# Altium project Senior Design.PrjPcb (part 1 of 2)
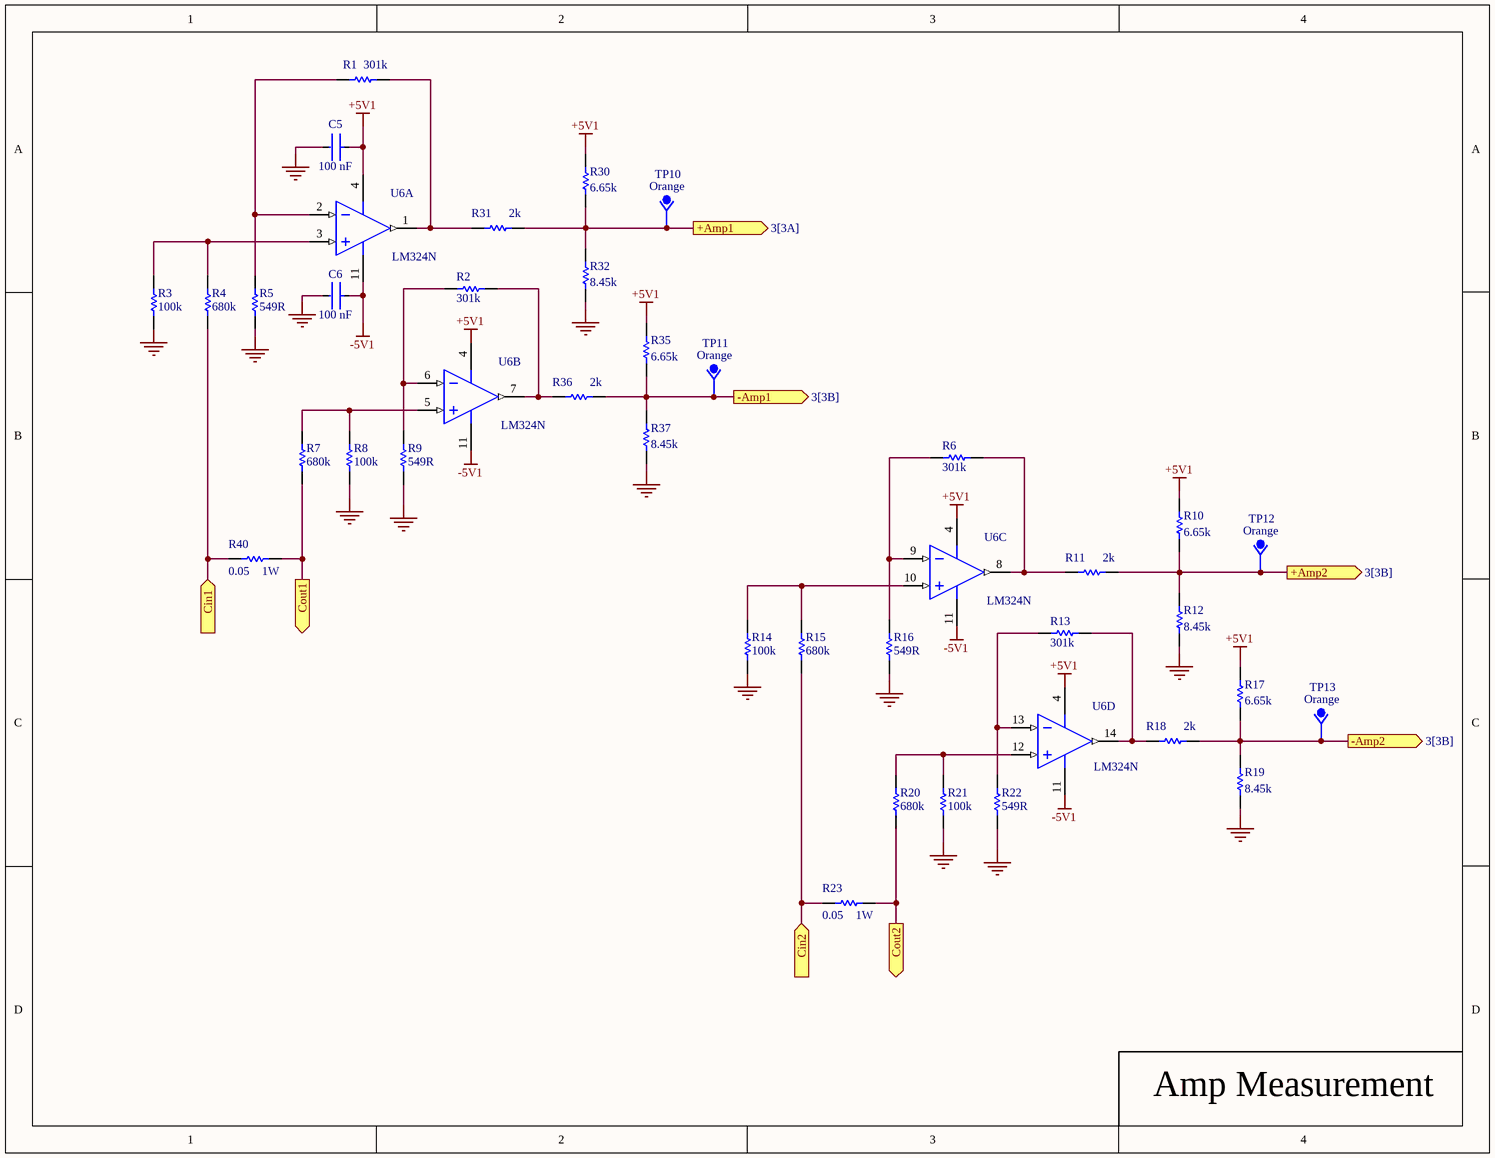
[diagram p0: Amp_Measurement.SchDoc]
3 sheets, 127 parts. Net scope: flat (ports and power ports of the same name join across sheets).
Board file: PCB.PcbDoc
Sheets:
  Amp_Measurement.SchDoc
  Volt_Measurement.SchDoc
  Data-Power.SchDoc

## Sheet Amp_Measurement.SchDoc
size Letter; SheetNumber: 1; SheetTotal: 3; SPICEModelCacheDOOVHHKG: <root> / <DocumentId>DOOVHHKG</DocumentId> / </root>; SheetName: Amp Measurement

### Parts
C5  value 100 nF  [FP-CC0805-0_85-MFG]  (hidden comment: 100nF)
C6  value 100 nF  [FP-CC0805-0_85-MFG]  (hidden comment: 100nF)
R1  value 301k  [0805 Res]  (hidden comment: 301k Ohm)
R2  value 301k  [0805 Res]  (hidden comment: 301k Ohm)
R3  value 100k  [0805 Res]  (hidden comment: 100k Ohm)
R4  value 680k  [0805 Res]  (hidden comment: 680k Ohm)
R5  value 549R  [0805 Res]  (hidden comment: 549 Ohm)
R6  value 301k  [0805 Res]  (hidden comment: 301k Ohm)
R7  value 680k  [0805 Res]  (hidden comment: 680k Ohm)
R8  value 100k  [0805 Res]  (hidden comment: 100k Ohm)
R9  value 549R  [0805 Res]  (hidden comment: 549 Ohm)
R10  value 6.65k  [0805 Res]  (hidden comment: 6.65k Ohm)
R11  value 2k  [0805 Res]  (hidden comment: 2k Ohm)
R12  value 8.45k  [0805 Res]  (hidden comment: 8.45k Ohm)
R13  value 301k  [0805 Res]  (hidden comment: 301k Ohm)
R14  value 100k  [0805 Res]  (hidden comment: 100k Ohm)
R15  value 680k  [0805 Res]  (hidden comment: 680k Ohm)
R16  value 549R  [0805 Res]  (hidden comment: 549 Ohm)
R17  value 6.65k  [0805 Res]  (hidden comment: 6.65k Ohm)
R18  value 2k  [0805 Res]  (hidden comment: 2k Ohm)
R19  value 8.45k  [0805 Res]  (hidden comment: 8.45k Ohm)
R20  value 680k  [0805 Res]  (hidden comment: 680k Ohm)
R21  value 100k  [0805 Res]  (hidden comment: 100k Ohm)
R22  value 549R  [0805 Res]  (hidden comment: 549 Ohm)
R23  value 0.05  Power: 1W  [1206 Res]  (hidden comment: 0.05 Ohm, 1W)
R30  value 6.65k  [0805 Res]  (hidden comment: 6.65k Ohm)
R31  value 2k  [0805 Res]  (hidden comment: 2k Ohm)
R32  value 8.45k  [0805 Res]  (hidden comment: 8.45k Ohm)
R35  value 6.65k  [0805 Res]  (hidden comment: 6.65k Ohm)
R36  value 2k  [0805 Res]  (hidden comment: 2k Ohm)
R37  value 8.45k  [0805 Res]  (hidden comment: 8.45k Ohm)
R40  value 0.05  Power: 1W  [1206 Res]  (hidden comment: 0.05 Ohm, 1W)
TP10  Color: Orange  [ORANGETP]  (hidden comment: TP (Orange))
TP11  Color: Orange  [ORANGETP]  (hidden comment: TP (Orange))
TP12  Color: Orange  [ORANGETP]  (hidden comment: TP (Orange))
TP13  Color: Orange  [ORANGETP]  (hidden comment: TP (Orange))
U6  Manufacturer Part Number: LM324N  [N0014A]  (hidden comment: 4CH Op-Amp)  (parts A,B,C,D of 4)

### Ports
+Amp1 (out, see 3[3A]), +Amp2 (out, see 3[3B]), -Amp1 (out, see 3[3B]), -Amp2 (out, see 3[3B]), Cin1 (in), Cin2 (in), Cout1 (out), Cout2 (out)

### Nets
+5V1: C5.1 R10.2 R17.2 R30.2 R35.2 U6.4(V+)
-5V1: C6.1 U6.11(GND)
GND: C5.2 C6.2 R3.2 R5.1 R8.2 R9.1 R12.1 R14.2 R16.1 R19.1 R21.2 R22.1 R32.1 R37.1
NetR1_1: R1.1 R31.2 U6.1(OUT1)
NetR1_2: R1.2 R5.2 U6.2(IN1-)
NetR2_1: R2.1 R36.2 U6.7(OUT2)
NetR2_2: R2.2 R9.2 U6.6(IN2-)
NetR3_1: R3.1 R4.2 U6.3(IN1+)
NetR4_1: R4.1 R40.1 ; port Cin1
NetR6_1: R6.1 R11.2 U6.8(OUT3)
NetR6_2: R6.2 R16.2 U6.9(IN3-)
NetR7_1: R7.1 R40.2 ; port Cout1
NetR7_2: R7.2 R8.1 U6.5(IN2+)
NetR10_1: R10.1 R11.1 R12.2 TP12.1(TP) ; port +Amp2
NetR13_1: R13.1 R18.2 U6.14(OUT4)
NetR13_2: R13.2 R22.2 U6.13(IN4-)
NetR14_1: R14.1 R15.2 U6.10(IN3+)
NetR15_1: R15.1 R23.1 ; port Cin2
NetR17_1: R17.1 R18.1 R19.2 TP13.1(TP) ; port -Amp2
NetR20_1: R20.1 R23.2 ; port Cout2
NetR20_2: R20.2 R21.1 U6.12(IN4+)
NetR30_1: R30.1 R31.1 R32.2 TP10.1(TP) ; port +Amp1
NetR35_1: R35.1 R36.1 R37.2 TP11.1(TP) ; port -Amp1

### Library data of the parts
C5 C6 = CMP-1036-04402-6: CAP CER 0.1UF 16V X7R 0805; Manufacturer Part Number: CC0805KRX7R7BB104; Manufacturer: Yageo; Material: Ceramic; Tolerance: 0.1; Temperature: -30°C to +85°C; Lead Free: Yes; Footprint Url: http://www.yageo.com/exep/pages/download/literatures/UPY-C_GEN_24.pdf; Voltage Rating: 16 V; Package: CC0805-0.85; RoHS: TRUE; Digikey Description: CAP CER 0.1UF 16V X7R 0805; Category: Cap; Octopart: https://octopart.com/cc0805krx7r7bb104-yageo-39467769; Capacitance: 100 nF; Device Class L3: Ceramic Capacitors; ComponentLink2URL: http://www.yageo.com/documents/recent/UPY-GPHC_Y5V_6.3V-to-50V_8.pdf; Temperature Range Low: -30°C; Mouser Description: Multilayer Ceramic Capacitors MLCC - SMD/SMT 100nF 16V X7R 10%; Automotive: No; Device Class L2: Capacitors; Height: 0.95mm; ComponentLink2Description: Datasheet; Temperature Characteristic: X7R; Ipc Land Pattern Name: CAPC200125X85; Device Class L1: Passive Components; Temperature Range High: +85°C
R1 R2 R6 R13 = Res1: Fixed Resistor, Metal Glaze/thick Film, 0.125W, 301000ohm, 150V, 1% +/-Tol, 100ppm/Cel, Surface Mount, 0805; Manufacturer: Stackpole Electronics; Manufacturer Part Number: RMCF0805JT100K; Tolerance: 5%; Power: 125mW; Rated Temperature: 70°C; Temperature Coefficient (ppm/Cel): 200; Package Height: 0.5mm; Package Length: 2mm; Package Width: 1.25mm; Reference Standard: AEC-Q200; Published: 8-Jun-2000; LatestRevisionDate: 17-Jul-2002; LatestRevisionNote: Re-released for DXP Platform.; PackageReference: AXIAL-0.3; Publisher: Altium Limited; PackageDescription: Axial Device, Thru-Hole; 2 Leads; 0.3 in Pin Spacing; Supplier 1: Avnet; Supplier Part Number 1: RMCF0805JT100K; RoHS: Yes; Category: Chip SMD Resistors; Stock 1: 1265000; Pricing 1: 5000=0.00196, 10000=0.00193, 20000=0.0019, 30000=0.00188, 40000=0.00185 (USD); Mounting Technology: Surface Mount; Pins: 2; Package Shape: Rectangular; Case/Package: 0805; Terminal Finish: Nickel; Min Operating Temperature: -55°C; Max Operating Temperature: 155°C; JESD-609 Code: e3; Resistor Type: FIXED RESISTOR; Construction: Rectangular; Packaging: Tape and Reel; Technology: METAL GLAZE/THICK FILM; Termination: Wraparound; Working Voltage: 150V; Reach SVHC Compliant: Yes; RoHS Compliant: Yes; ComponentLink1URL: https://datasheet.ciiva.com:443/pdfs/VipMasterIC/IC/SEIE/SEIE-S-A0009541969/SEIE-S-A0009541969-1.pdf?src-supplier=IHS+Markit; ComponentLink1Description: https://datasheet.ciiva.com:443/pdfs/VipMasterIC/IC/SEIE/SEIE-S-A0009541969/SEIE-S-A0009541969-1.pdf?src-supplier=IHS+Markit; ComponentLink2URL: http://components.arrow.com/part/dataview/50503311S7171745N1174?src-supplier=Arrow+Electronics; ComponentLink2Description: http://components.arrow.com/part/dataview/50503311S7171745N1174?src-supplier=Arrow+Electronics; ComponentLink3URL: https://www.seielect.com/catalog/SEI-Packaging.pdf?src-supplier=Digikey; ComponentLink3Description: https://www.seielect.com/catalog/SEI-Packaging.pdf?src-supplier=Digikey; ComponentLink4URL: https://www.verical.com/server-webapp/html/getDatasheet?partID=366462&src-supplier=Verical; ComponentLink4Description: https://www.verical.com/server-webapp/html/getDatasheet?partID=366462&src-supplier=Verical; ComponentLink5URL: https://www.seielect.com/catalog/SEI-RMCF_RMCP.pdf?src-supplier=Avnet; ComponentLink5Description: https://www.seielect.com/catalog/SEI-RMCF_RMCP.pdf?src-supplier=Avnet; ComponentLink6URL: https://datasheet.octopart.com/RMCF0805JT100K-Stackpole-Electronics-datasheet-11547379.pdf?src-supplier=Future+Electronics; ComponentLink6Description: https://datasheet.octopart.com/RMCF0805JT100K-Stackpole-Electronics-datasheet-11547379.pdf?src-supplier=Future+Electronics; ComponentLink7URL: http://www.seielect.com/catalog/sei-rmc.pdf?src-supplier=Future+Electronics; ComponentLink7Description: http://www.seielect.com/catalog/sei-rmc.pdf?src-supplier=Future+Electronics; Supplier 2: Digikey; Supplier Part Number 2: RMCF0805FT301KCT-ND; Stock 2: 115941; Pricing 2: 1=0.1, 10=0.021, 50=0.0126, 100=0.0104, 500=0.00696, 1000=0.00594 (USD); ComponentLink8URL: https://datasheet.ciiva.com/3882/40960751s7172021n1174-3882844.pdf?src-supplier=Arrow+Electronics; ComponentLink8Description: https://datasheet.ciiva.com/3882/40960751s7172021n1174-3882844.pdf?src-supplier=Arrow+Electronics; ComponentLink9URL: https://datasheet.ciiva.com/15193/getdatasheetpartid-408027-15193573.pdf?src-supplier=Verical; ComponentLink9Description: https://datasheet.ciiva.com/15193/getdatasheetpartid-408027-15193573.pdf?src-supplier=Verical
R3 R8 R14 R21 = Res1: Fixed Resistor, Metal Glaze/thick Film, 0.125W, 100000ohm, 150V, 1% +/-Tol, 100ppm/Cel, Surface Mount, 0805; Manufacturer: Stackpole Electronics; Manufacturer Part Number: RMCF0805FT100K; Power: 125mW; Rated Temperature: 70°C; Temperature Coefficient (ppm/Cel): 100; Package Height: 0.5mm; Package Length: 2mm; Package Width: 1.25mm; Reference Standard: AEC-Q200; Published: 8-Jun-2000; LatestRevisionDate: 17-Jul-2002; LatestRevisionNote: Re-released for DXP Platform.; PackageReference: AXIAL-0.3; Publisher: Altium Limited; PackageDescription: Axial Device, Thru-Hole; 2 Leads; 0.3 in Pin Spacing; Supplier 1: Avnet; Supplier Part Number 1: RMCF0805FT100K; RoHS: Yes; Category: Chip SMD Resistors; Stock 1: 1060000; Pricing 1: 5000=0.00252, 10000=0.00248, 20000=0.00245, 30000=0.00241, 40000=0.00238 (USD); Mounting Technology: Surface Mount; Pins: 2; Package Shape: Rectangular; Case/Package: 0805; Terminal Finish: Nickel; Min Operating Temperature: -55°C; Max Operating Temperature: 155°C; Tolerance: 1%; JESD-609 Code: e3; Resistor Type: FIXED RESISTOR; Construction: Rectangular; Packaging: Tape and Reel; Technology: METAL GLAZE/THICK FILM; Termination: Wraparound; Working Voltage: 150V; Reach SVHC Compliant: Yes; RoHS Compliant: Yes; ComponentLink1URL: https://datasheet.ciiva.com:443/pdfs/VipMasterIC/IC/SEIE/SEIE-S-A0009541969/SEIE-S-A0009541969-1.pdf?src-supplier=IHS+Markit; ComponentLink1Description: https://datasheet.ciiva.com:443/pdfs/VipMasterIC/IC/SEIE/SEIE-S-A0009541969/SEIE-S-A0009541969-1.pdf?src-supplier=IHS+Markit; ComponentLink2URL: http://components.arrow.com/part/dataview/50568053S7005095N1174?src-supplier=Arrow+Electronics; ComponentLink2Description: http://components.arrow.com/part/dataview/50568053S7005095N1174?src-supplier=Arrow+Electronics; ComponentLink3URL: https://www.seielect.com/catalog/SEI-Packaging.pdf?src-supplier=Digikey; ComponentLink3Description: https://www.seielect.com/catalog/SEI-Packaging.pdf?src-supplier=Digikey; ComponentLink4URL: https://www.seielect.com/catalog/SEI-RMCF_RMCP.pdf?src-supplier=Avnet; ComponentLink4Description: https://www.seielect.com/catalog/SEI-RMCF_RMCP.pdf?src-supplier=Avnet; ComponentLink5URL: http://www.onlinecomponents.com/productFiles/mf-SEI/sei-rmcp.pdf?src-supplier=Onlinecomponents.com; ComponentLink5Description: http://www.onlinecomponents.com/productFiles/mf-SEI/sei-rmcp.pdf?src-supplier=Onlinecomponents.com; ComponentLink6URL: http://www.seielect.com/catalog/sei-rmc.pdf?src-supplier=Future+Electronics; ComponentLink6Description: http://www.seielect.com/catalog/sei-rmc.pdf?src-supplier=Future+Electronics; ComponentLink7URL: https://www.verical.com/server-webapp/html/getDatasheet?partID=360692&src-supplier=Verical; ComponentLink7Description: https://www.verical.com/server-webapp/html/getDatasheet?partID=360692&src-supplier=Verical; ComponentLink8URL: https://datasheet.octopart.com/RMCF0805FT100K-Stackpole-Electronics-datasheet-11547379.pdf?src-supplier=Future+Electronics; ComponentLink8Description: https://datasheet.octopart.com/RMCF0805FT100K-Stackpole-Electronics-datasheet-11547379.pdf?src-supplier=Future+Electronics; ComponentLink9URL: https://datasheet.octopart.com/RMCF0805FT100K-Stackpole-Electronics-datasheet-155966809.pdf?src-supplier=Electro+Sonic; ComponentLink9Description: https://datasheet.octopart.com/RMCF0805FT100K-Stackpole-Electronics-datasheet-155966809.pdf?src-supplier=Electro+Sonic; ComponentLink10URL: https://datasheet.octopart.com/RMCF0805FT100K-Stackpole-Electronics-datasheet-154799224.pdf?src-supplier=Master+Electronics; ComponentLink10Description: https://datasheet.octopart.com/RMCF0805FT100K-Stackpole-Electronics-datasheet-154799224.pdf?src-supplier=Master+Electronics
R4 R7 R15 R20 = Res1: Fixed Resistor, Metal Glaze/thick Film, 0.125W, 680000ohm, 150V, 1% +/-Tol, 100ppm/Cel, Surface Mount, 0805; Manufacturer: Stackpole Electronics; Manufacturer Part Number: RMCF0805FT680K; Power: 125mW; Rated Temperature: 70°C; Temperature Coefficient (ppm/Cel): 100; Package Height: 0.5mm; Package Length: 2mm; Package Width: 1.25mm; Reference Standard: AEC-Q200; Published: 8-Jun-2000; LatestRevisionDate: 17-Jul-2002; LatestRevisionNote: Re-released for DXP Platform.; PackageReference: AXIAL-0.3; Publisher: Altium Limited; PackageDescription: Axial Device, Thru-Hole; 2 Leads; 0.3 in Pin Spacing; Supplier 1: Avnet; Supplier Part Number 1: RMCF0805FT680K; RoHS: Yes; Category: Chip SMD Resistors; Stock 1: 95000; Pricing 1: 5000=0.00252, 10000=0.00248, 20000=0.00245, 30000=0.00241, 40000=0.00238 (USD); Mounting Technology: Surface Mount; Pins: 2; Package Shape: Rectangular; Case/Package: 0805; Terminal Finish: Nickel; Min Operating Temperature: -55°C; Max Operating Temperature: 155°C; Tolerance: 1%; JESD-609 Code: e3; Resistor Type: FIXED RESISTOR; Construction: Rectangular; Packaging: Tape and Reel; Technology: METAL GLAZE/THICK FILM; Termination: Wraparound; Working Voltage: 150V; Reach SVHC Compliant: Yes; RoHS Compliant: Yes; ComponentLink1URL: https://datasheet.ciiva.com:443/pdfs/VipMasterIC/IC/SEIE/SEIE-S-A0009541969/SEIE-S-A0009541969-1.pdf?src-supplier=IHS+Markit; ComponentLink1Description: https://datasheet.ciiva.com:443/pdfs/VipMasterIC/IC/SEIE/SEIE-S-A0009541969/SEIE-S-A0009541969-1.pdf?src-supplier=IHS+Markit; ComponentLink2URL: https://www.seielect.com/catalog/sei-packaging.pdf?src-supplier=Digikey; ComponentLink2Description: https://www.seielect.com/catalog/sei-packaging.pdf?src-supplier=Digikey; ComponentLink3URL: https://www.seielect.com/catalog/SEI-RMCF_RMCP.pdf?src-supplier=Avnet; ComponentLink3Description: https://www.seielect.com/catalog/SEI-RMCF_RMCP.pdf?src-supplier=Avnet; ComponentLink4URL: https://datasheet.octopart.com/RMCF0805FT680K-Stackpole-Electronics-datasheet-140082676.pdf?src-supplier=LKR; ComponentLink4Description: https://datasheet.octopart.com/RMCF0805FT680K-Stackpole-Electronics-datasheet-140082676.pdf?src-supplier=LKR
R5 R9 R16 R22 = Res1: Fixed Resistor, Metal Glaze/thick Film, 0.125W, 549ohm, 150V, 1% +/-Tol, 100ppm/Cel, Surface Mount, 0805; Manufacturer: Stackpole Electronics; Manufacturer Part Number: RMCF0805FT549R; Power: 125mW; Rated Temperature: 70°C; Temperature Coefficient (ppm/Cel): 100; Package Height: 0.5mm; Package Length: 2mm; Package Width: 1.25mm; Reference Standard: AEC-Q200; Supplier 1: Avnet; Supplier Part Number 1: RMCF0805FT549R; RoHS: Yes; Category: Chip SMD Resistors; Stock 1: 55000; Pricing 1: 5000=0.00252, 10000=0.00248, 20000=0.00245, 30000=0.00241, 40000=0.00238 (USD); Mounting Technology: Surface Mount; Pins: 2; Package Shape: Rectangular; Case/Package: 0805; Terminal Finish: Nickel; Min Operating Temperature: -55°C; Max Operating Temperature: 155°C; Tolerance: 1%; JESD-609 Code: e3; Resistor Type: FIXED RESISTOR; Construction: Rectangular; Packaging: Tape and Reel; Technology: METAL GLAZE/THICK FILM; Termination: Wraparound; Working Voltage: 150V; Reach SVHC Compliant: Yes; RoHS Compliant: Yes
  R9: ComponentLink1URL: https://datasheet.ciiva.com:443/pdfs/VipMasterIC/IC/SEIE/SEIE-S-A0009541969/SEIE-S-A0009541969-1.pdf?src-supplier=IHS+Markit; ComponentLink1Description: https://datasheet.ciiva.com:443/pdfs/VipMasterIC/IC/SEIE/SEIE-S-A0009541969/SEIE-S-A0009541969-1.pdf?src-supplier=IHS+Markit; ComponentLink2URL: https://datasheet.ciiva.com/15193/getdatasheetpartid-360136-15193546.pdf?src-supplier=Verical; ComponentLink2Description: https://datasheet.ciiva.com/15193/getdatasheetpartid-360136-15193546.pdf?src-supplier=Verical; ComponentLink3URL: http://components.arrow.com/part/dataview/50575321S380759N1174?src-supplier=Arrow+Electronics; ComponentLink3Description: http://components.arrow.com/part/dataview/50575321S380759N1174?src-supplier=Arrow+Electronics; ComponentLink4URL: https://www.seielect.com/catalog/sei-packaging.pdf?src-supplier=Digikey; ComponentLink4Description: https://www.seielect.com/catalog/sei-packaging.pdf?src-supplier=Digikey; ComponentLink5URL: https://www.seielect.com/catalog/SEI-RMCF_RMCP.pdf?src-supplier=Avnet; ComponentLink5Description: https://www.seielect.com/catalog/SEI-RMCF_RMCP.pdf?src-supplier=Avnet
R10 R17 R30 R35 = Res1: Fixed Resistor, Metal Glaze/thick Film, 0.125W, 6650ohm, 150V, 1% +/-Tol, 100ppm/Cel, Surface Mount, 0805; Manufacturer: Stackpole Electronics; Manufacturer Part Number: RMCF0805FT6K65; Power: 125mW; Rated Temperature: 70°C; Temperature Coefficient (ppm/Cel): 100; Package Height: 0.5mm; Package Length: 2mm; Package Width: 1.25mm; Reference Standard: AEC-Q200; ComponentLink1URL: https://datasheet.ciiva.com:443/pdfs/VipMasterIC/IC/SEIE/SEIE-S-A0009541969/SEIE-S-A0009541969-1.pdf?src-supplier=IHS+Markit; ComponentLink1Description: https://datasheet.ciiva.com:443/pdfs/VipMasterIC/IC/SEIE/SEIE-S-A0009541969/SEIE-S-A0009541969-1.pdf?src-supplier=IHS+Markit; ComponentLink3URL: https://www.seielect.com/catalog/SEI-RMCF_RMCP.pdf?src-supplier=Avnet; ComponentLink3Description: https://www.seielect.com/catalog/SEI-RMCF_RMCP.pdf?src-supplier=Avnet; ComponentLink4URL: https://www.seielect.com/catalog/sei-rmcf_rmcp.pdf?src-supplier=Digikey; ComponentLink4Description: https://www.seielect.com/catalog/sei-rmcf_rmcp.pdf?src-supplier=Digikey; ComponentLink5URL: https://www.seielect.com/catalog/SEI-Packaging.pdf?src-supplier=Digikey; ComponentLink5Description: https://www.seielect.com/catalog/SEI-Packaging.pdf?src-supplier=Digikey; Supplier 1: Avnet; Supplier Part Number 1: RMCF0805FT6K65; RoHS: Yes; Category: Chip SMD Resistors; Stock 1: 10000; Pricing 1: 5000=0.00252, 10000=0.00248, 20000=0.00245, 30000=0.00241, 40000=0.00238 (USD); Mounting Technology: Surface Mount; Pins: 2; Package Shape: Rectangular; Case/Package: 0805; Terminal Finish: Nickel; Min Operating Temperature: -55°C; Max Operating Temperature: 155°C; Tolerance: 1%; JESD-609 Code: e3; Resistor Type: FIXED RESISTOR; Construction: Rectangular; Packaging: Tape and Reel; Technology: METAL GLAZE/THICK FILM; Termination: Wraparound; Working Voltage: 150V; Reach SVHC Compliant: Yes; RoHS Compliant: Yes
  R10 R17 R35: ComponentLink2URL: http://components.arrow.com/part/dataview/47797196S7482950N1174?src-supplier=Arrow+Electronics; ComponentLink2Description: http://components.arrow.com/part/dataview/47797196S7482950N1174?src-supplier=Arrow+Electronics; ComponentLink6URL: https://datasheet.octopart.com/RMCF0805FT6K49-Stackpole-Electronics-datasheet-12534581.pdf?src-supplier=Future+Electronics; ComponentLink6Description: https://datasheet.octopart.com/RMCF0805FT6K49-Stackpole-Electronics-datasheet-12534581.pdf?src-supplier=Future+Electronics; ComponentLink7URL: http://components.arrow.com/part/dataview/44987968S7295135N1174?src-supplier=Arrow+Electronics; ComponentLink7Description: http://components.arrow.com/part/dataview/44987968S7295135N1174?src-supplier=Arrow+Electronics; ComponentLink8URL: https://datasheet.octopart.com/RMCF0805FT6K65-Stackpole-Electronics-datasheet-28504820.pdf?src-supplier=Future+Electronics; ComponentLink8Description: https://datasheet.octopart.com/RMCF0805FT6K65-Stackpole-Electronics-datasheet-28504820.pdf?src-supplier=Future+Electronics
  R30: ComponentLink2URL: http://components.arrow.com/part/dataview/44987968S7295135N1174?src-supplier=Arrow+Electronics; ComponentLink2Description: http://components.arrow.com/part/dataview/44987968S7295135N1174?src-supplier=Arrow+Electronics; ComponentLink6URL: https://datasheet.octopart.com/RMCF0805FT6K65-Stackpole-Electronics-datasheet-28504820.pdf?src-supplier=Future+Electronics; ComponentLink6Description: https://datasheet.octopart.com/RMCF0805FT6K65-Stackpole-Electronics-datasheet-28504820.pdf?src-supplier=Future+Electronics
R11 R18 R31 R36 = Res1: Fixed Resistor, Metal Glaze/thick Film, 0.125W, 2000ohm, 150V, 1% +/-Tol, 100ppm/Cel, Surface Mount, 0805; Manufacturer: Stackpole Electronics; Manufacturer Part Number: RMCF0805FT2K00; Power: 125mW; Rated Temperature: 70°C; Temperature Coefficient (ppm/Cel): 100; Package Height: 0.5mm; Package Length: 2mm; Package Width: 1.25mm; Reference Standard: AEC-Q200; Supplier 1: Avnet; Supplier Part Number 1: RMCF0805FT2K00; RoHS: Yes; Category: Chip SMD Resistors; Stock 1: 515000; Pricing 1: 5000=0.00252, 10000=0.00248, 20000=0.00245, 30000=0.00241, 40000=0.00238 (USD); Mounting Technology: Surface Mount; Pins: 2; Package Shape: Rectangular; Case/Package: 0805; Terminal Finish: Nickel; Min Operating Temperature: -55°C; Max Operating Temperature: 155°C; Tolerance: 1%; JESD-609 Code: e3; Resistor Type: FIXED RESISTOR; Construction: Rectangular; Packaging: Tape and Reel; Technology: METAL GLAZE/THICK FILM; Termination: Wraparound; Working Voltage: 150V; Reach SVHC Compliant: Yes; RoHS Compliant: Yes
  R18 R31 R36: ComponentLink1URL: https://datasheet.ciiva.com:443/pdfs/VipMasterIC/IC/SEIE/SEIE-S-A0009541969/SEIE-S-A0009541969-1.pdf?src-supplier=IHS+Markit; ComponentLink1Description: https://datasheet.ciiva.com:443/pdfs/VipMasterIC/IC/SEIE/SEIE-S-A0009541969/SEIE-S-A0009541969-1.pdf?src-supplier=IHS+Markit; ComponentLink2URL: https://www.seielect.com/catalog/sei-rmcf_rmcp.pdf?src-supplier=Digikey; ComponentLink2Description: https://www.seielect.com/catalog/sei-rmcf_rmcp.pdf?src-supplier=Digikey; ComponentLink3URL: https://www.seielect.com/catalog/SEI-Packaging.pdf?src-supplier=Digikey; ComponentLink3Description: https://www.seielect.com/catalog/SEI-Packaging.pdf?src-supplier=Digikey; ComponentLink4URL: http://www.seielect.com/Catalog/SEI-RMCF_RMCP.pdf?src-supplier=Digikey; ComponentLink4Description: http://www.seielect.com/Catalog/SEI-RMCF_RMCP.pdf?src-supplier=Digikey; ComponentLink5URL: https://www.seielect.com/catalog/SEI-RMCF_RMCP.pdf?src-supplier=Avnet; ComponentLink5Description: https://www.seielect.com/catalog/SEI-RMCF_RMCP.pdf?src-supplier=Avnet; ComponentLink6URL: http://components.arrow.com/part/dataview/50507890S7171789N1174?src-supplier=Arrow+Electronics; ComponentLink6Description: http://components.arrow.com/part/dataview/50507890S7171789N1174?src-supplier=Arrow+Electronics; ComponentLink7URL: https://www.verical.com/server-webapp/html/getDatasheet?partID=362048&src-supplier=Verical; ComponentLink7Description: https://www.verical.com/server-webapp/html/getDatasheet?partID=362048&src-supplier=Verical; ComponentLink8URL: https://datasheet.octopart.com/RMCF0805FT2K00-Stackpole-Electronics-datasheet-11547379.pdf?src-supplier=Future+Electronics; ComponentLink8Description: https://datasheet.octopart.com/RMCF0805FT2K00-Stackpole-Electronics-datasheet-11547379.pdf?src-supplier=Future+Electronics; ComponentLink9URL: http://www.seielect.com/Catalog/SEI-rmc.pdf?src-supplier=Future+Electronics; ComponentLink9Description: http://www.seielect.com/Catalog/SEI-rmc.pdf?src-supplier=Future+Electronics
R12 R19 R32 R37 = Res1: Fixed Resistor, Metal Glaze/thick Film, 0.125W, 8450ohm, 150V, 1% +/-Tol, 100ppm/Cel, Surface Mount, 0805; Manufacturer: Stackpole Electronics; Manufacturer Part Number: RMCF0805FT8K45; Power: 125mW; Rated Temperature: 70°C; Temperature Coefficient (ppm/Cel): 100; Package Height: 0.5mm; Package Length: 2mm; Package Width: 1.25mm; Reference Standard: AEC-Q200; ComponentLink1URL: https://datasheet.ciiva.com:443/pdfs/VipMasterIC/IC/SEIE/SEIE-S-A0009541969/SEIE-S-A0009541969-1.pdf?src-supplier=IHS+Markit; ComponentLink1Description: https://datasheet.ciiva.com:443/pdfs/VipMasterIC/IC/SEIE/SEIE-S-A0009541969/SEIE-S-A0009541969-1.pdf?src-supplier=IHS+Markit; ComponentLink3URL: https://www.seielect.com/catalog/SEI-RMCF_RMCP.pdf?src-supplier=Avnet; ComponentLink3Description: https://www.seielect.com/catalog/SEI-RMCF_RMCP.pdf?src-supplier=Avnet; Supplier 1: Avnet; Supplier Part Number 1: RMCF0805FT8K45; RoHS: Yes; Category: Chip SMD Resistors; Stock 1: 115000; Pricing 1: 5000=0.00252, 10000=0.00248, 20000=0.00245, 30000=0.00241, 40000=0.00238 (USD); Mounting Technology: Surface Mount; Pins: 2; Package Shape: Rectangular; Case/Package: 0805; Terminal Finish: Nickel; Min Operating Temperature: -55°C; Max Operating Temperature: 155°C; Tolerance: 1%; JESD-609 Code: e3; Resistor Type: FIXED RESISTOR; Construction: Rectangular; Packaging: Tape and Reel; Technology: METAL GLAZE/THICK FILM; Termination: Wraparound; Working Voltage: 150V; Reach SVHC Compliant: Yes; RoHS Compliant: Yes
  R12 R19 R37: ComponentLink2URL: http://components.arrow.com/part/dataview/47797196S7482950N1174?src-supplier=Arrow+Electronics; ComponentLink2Description: http://components.arrow.com/part/dataview/47797196S7482950N1174?src-supplier=Arrow+Electronics; ComponentLink4URL: https://www.seielect.com/catalog/sei-rmcf_rmcp.pdf?src-supplier=Digikey; ComponentLink4Description: https://www.seielect.com/catalog/sei-rmcf_rmcp.pdf?src-supplier=Digikey; ComponentLink5URL: https://www.seielect.com/catalog/SEI-Packaging.pdf?src-supplier=Digikey; ComponentLink5Description: https://www.seielect.com/catalog/SEI-Packaging.pdf?src-supplier=Digikey; ComponentLink6URL: https://datasheet.octopart.com/RMCF0805FT6K49-Stackpole-Electronics-datasheet-12534581.pdf?src-supplier=Future+Electronics; ComponentLink6Description: https://datasheet.octopart.com/RMCF0805FT6K49-Stackpole-Electronics-datasheet-12534581.pdf?src-supplier=Future+Electronics; ComponentLink7URL: https://datasheet.octopart.com/RMCF0805FT8K45-Stackpole-Electronics-datasheet-141193804.pdf?src-supplier=Future+Electronics; ComponentLink7Description: https://datasheet.octopart.com/RMCF0805FT8K45-Stackpole-Electronics-datasheet-141193804.pdf?src-supplier=Future+Electronics
  R32: ComponentLink2URL: https://www.seielect.com/catalog/sei-rmcf_rmcp.pdf?src-supplier=Digikey; ComponentLink2Description: https://www.seielect.com/catalog/sei-rmcf_rmcp.pdf?src-supplier=Digikey; ComponentLink4URL: https://datasheet.octopart.com/RMCF0805FT8K45-Stackpole-Electronics-datasheet-141193804.pdf?src-supplier=Future+Electronics; ComponentLink4Description: https://datasheet.octopart.com/RMCF0805FT8K45-Stackpole-Electronics-datasheet-141193804.pdf?src-supplier=Future+Electronics
R23 R40 = Res1: Fixed Resistor, Metal Glaze/thick Film, 1W, 0.05ohm, 1% +/-Tol, 75ppm/Cel, Surface Mount, 1206; Manufacturer: Panasonic; Manufacturer Part Number: ERJ-8CWFR050V; Manufacturer Series: ERJ8CW; Rated Temperature: 70°C; Temperature Coefficient (ppm/Cel): 75; Reference Standard: AEC-Q200; ComponentLink1URL: https://datasheet.ciiva.com:443/pdfs/VipMasterIC/IC/OMIT/OMIT-S-A0004284475/OMIT-S-A0004284475-1.pdf?src-supplier=IHS+Markit; ComponentLink1Description: https://datasheet.ciiva.com:443/pdfs/VipMasterIC/IC/OMIT/OMIT-S-A0004284475/OMIT-S-A0004284475-1.pdf?src-supplier=IHS+Markit; ComponentLink2URL: https://datasheet.ciiva.com/11805/0900766b8003123a-11805433.pdf?src-supplier=Rs; ComponentLink2Description: https://datasheet.ciiva.com/11805/0900766b8003123a-11805433.pdf?src-supplier=Rs; Supplier 1: Mouser; Supplier Part Number 1: 667-ERJ-8CWFR050V; RoHS: Yes; Category: Chip SMD Resistors; Stock 1: 53345; Pricing 1: 1=0.42, 10=0.185, 50=0.185, 100=0.131, 1000=0.119, 5000=0.098, 10000=0.088, 25000=0.083, 50000=0.08 (USD); Mounting Technology: Surface Mount; Pins: 2; Package Shape: Rectangular; Case/Package: 1206; Terminal Finish: Tin; Min Operating Temperature: -55°C; Max Operating Temperature: 125°C; Tolerance: 1%; JESD-609 Code: e3; Resistor Type: FIXED RESISTOR; Packaging: Tape and Reel; Technology: METAL GLAZE/THICK FILM; Termination: Wraparound; Reach SVHC Compliant: Yes; RoHS Compliant: Yes; ComponentLink3URL: https://datasheet.ciiva.com:443/pdfs/VipMasterIC/IC/PANA/PANA-S-A0002276294/PANA-S-A0002276294-1.pdf?src-supplier=IHS+Markit; ComponentLink3Description: https://datasheet.ciiva.com:443/pdfs/VipMasterIC/IC/PANA/PANA-S-A0002276294/PANA-S-A0002276294-1.pdf?src-supplier=IHS+Markit; ComponentLink4URL: https://datasheet.ciiva.com/25631/0900766b81107548-25631070.pdf?src-supplier=Rs; ComponentLink4Description: https://datasheet.ciiva.com/25631/0900766b81107548-25631070.pdf?src-supplier=Rs
TP10-TP13 = TP: Orange Test Point; Manufacturer P/N: 5013; Manufacturer: Keystone; Manufacturer Part Number: 5003; Description: Interconnection Device; Supplier 1: Mouser; Supplier Part Number 1: 534-5003; RoHS: Yes; Category: Connectors; Stock 1: 79700; Pricing 1: 1=0.29, 10=0.29, 50=0.262, 100=0.222, 1000=0.173, 10000=0.143 (USD); Contact Finish - Termination: Silver (Ag); Connector Type: Interconnection Device; JESD-609 Code: e4; Reach SVHC Compliant: Yes; RoHS Compliant: Yes; ComponentLink1URL: https://datasheet.ciiva.com:443/pdfs/VipMasterIC/IC/KEYC/KEYCS01036/KEYCS02044-1.pdf?src-supplier=IHS+Markit; ComponentLink1Description: https://datasheet.ciiva.com:443/pdfs/VipMasterIC/IC/KEYC/KEYCS01036/KEYCS02044-1.pdf?src-supplier=IHS+Markit; ComponentLink2URL: https://datasheet.ciiva.com/22631/1703983-22631103.pdf?src-supplier=Element14; ComponentLink2Description: https://datasheet.ciiva.com/22631/1703983-22631103.pdf?src-supplier=Element14; ComponentLink3URL: https://datasheet.ciiva.com/4598/5000-5004-4598618.pdf?src-supplier=Mouser; ComponentLink3Description: https://datasheet.ciiva.com/4598/5000-5004-4598618.pdf?src-supplier=Mouser; ComponentLink4URL: https://datasheet.ciiva.com/16885/70182825-16885788.pdf?src-supplier=Allied+Electronics; ComponentLink4Description: https://datasheet.ciiva.com/16885/70182825-16885788.pdf?src-supplier=Allied+Electronics; ComponentLink5URL: https://datasheet.ciiva.com/1454/1703983-1454826.pdf?src-supplier=Element14; ComponentLink5Description: https://datasheet.ciiva.com/1454/1703983-1454826.pdf?src-supplier=Element14
U6 = CMP-0055-00082-3: Low Power Quad Operational Amplifier, 14-pin MDIP; Manufacturer: Texas Instruments; CompType: Amplifiers; PowerWise: N; PackageTopMarking: NSUZXYYTTE#*LM324N; PackageDescription: MDIP, .750 x .250 x.130in, 14 Lead, .100in Pitch; Package Reference: N0014A; RoHS: N; Code_JEDEC: MS-001-AA; ComponentLink1URL: http://www.ti.com/general/docs/lit/getliterature.tsp?genericPartNumber=LM324&fileType=pdf; ComponentLink1Description: Datasheet URL; PinCount: 14